# Altium schematic sheet Stuff.SchDoc
size A3
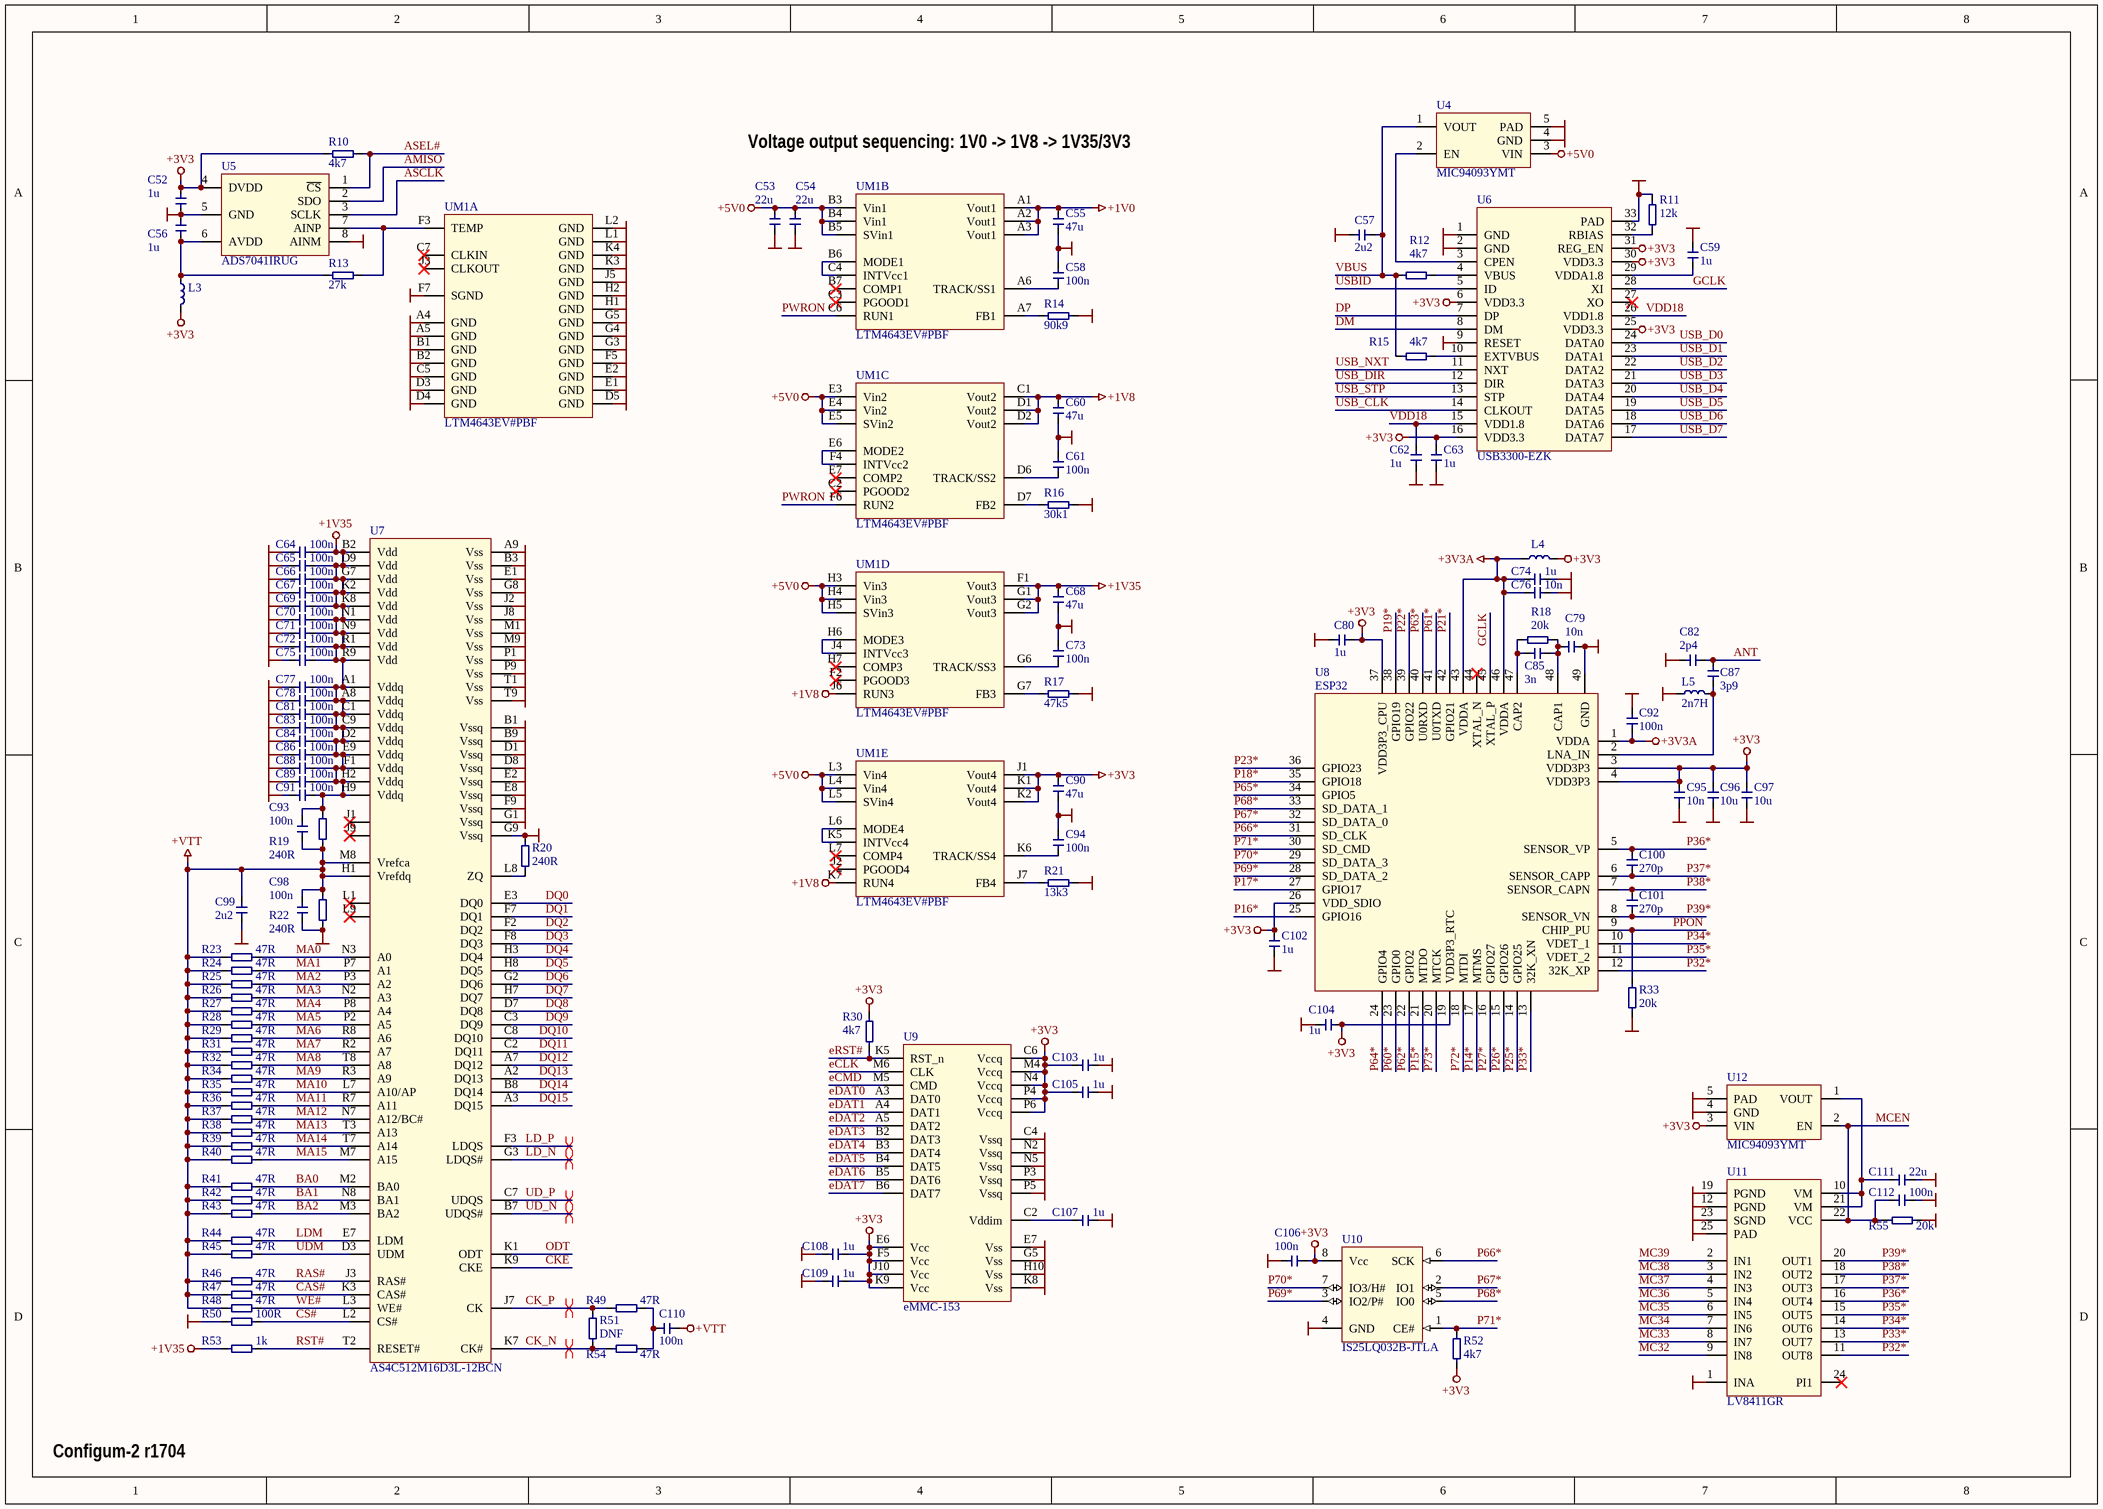
[diagram p0: Stuff.SchDoc]

## Parts
C52  1u  [_0201]
C53  22u  [_0805_CAP]
C54  22u  [_0805_CAP]
C55  47u  [_0805_CAP]
C56  1u  [_0201]
C57  2u2  [_0201]
C58  100n  [_0201]
C59  1u  [_0201]
C60  47u  [_0805_CAP]
C61  100n  [_0201]
C62  1u  [_0201]
C63  1u  [_0201]
C64  100n  [_0201]
C65  100n  [_0201]
C66  100n  [_0201]
C67  100n  [_0201]
C68  47u  [_0805_CAP]
C69  100n  [_0201]
C70  100n  [_0201]
C71  100n  [_0201]
C72  100n  [_0201]
C73  100n  [_0201]
C74  1u  [_0201]
C75  100n  [_0201]
C76  10n  [_0201]
C77  100n  [_0201]
C78  100n  [_0201]
C79  10n  [_0201]
C80  1u  [_0201]
C81  100n  [_0201]
C82  2p4  [_0201]
C83  100n  [_0201]
C84  100n  [_0201]
C85  3n  [_0201]
C86  100n  [_0201]
C87  3p9  [_0201]
C88  100n  [_0201]
C89  100n  [_0201]
C90  47u  [_0805_CAP]
C91  100n  [_0201]
C92  100n  [_0201]
C93  100n  [_0201]
C94  100n  [_0201]
C95  10n  [_0201]
C96  10u  [_0603]
C97  10u  [_0603]
C98  100n  [_0201]
C99  2u2  [_0201]
C100  270p  [_0201]
C101  270p  [_0201]
C102  1u  [_0201]
C103  1u  [_0201]
C104  1u  [_0201]
C105  1u  [_0201]
C106  100n  [_0201]
C107  1u  [_0201]
C108  1u  [_0201]
C109  1u  [_0201]
C110  100n  [_0201]
C111  22u  [_0805_CAP]
C112  100n  [_0201]
L3  60R/100MHz  [_0201]  (value not drawn)
L4  60R/100MHz  [_0201]  (value not drawn)
L5  2n7H  [_0201]
R10  4k7  [_0201]
R11  12k  [_0201]
R12  4k7  [_0201]
R13  27k  [_0201]
R14  90k9  [_0201]
R15  4k7  [_0201]
R16  30k1  [_0201]
R17  47k5  [_0201]
R18  20k  [_0201]
R19  240R  [_0201]
R20  240R  [_0201]
R21  13k3  [_0201]
R22  240R  [_0201]
R23  47R  [_0201]
R24  47R  [_0201]
R25  47R  [_0201]
R26  47R  [_0201]
R27  47R  [_0201]
R28  47R  [_0201]
R29  47R  [_0201]
R30  4k7  [_0201]
R31  47R  [_0201]
R32  47R  [_0201]
R33  20k  [_0201]
R34  47R  [_0201]
R35  47R  [_0201]
R36  47R  [_0201]
R37  47R  [_0201]
R38  47R  [_0201]
R39  47R  [_0201]
R40  47R  [_0201]
R41  47R  [_0201]
R42  47R  [_0201]
R43  47R  [_0201]
R44  47R  [_0201]
R45  47R  [_0201]
R46  47R  [_0201]
R47  47R  [_0201]
R48  47R  [_0201]
R49  47R  [_0201]
R50  100R  [_0201]
R51  DNF  [_0201]
R52  4k7  [_0201]
R53  1k  [_0201]
R54  47R  [_0201]
R55  20k  [_0201]
U4  MIC94093YMT  [DFN65P120x120-4]
U5  ADS7041IRUG  [X2QFN50P150X150-8]
U6  USB3300-EZK  [QFN50P500X500-32V5N]
U7  AS4C512M16D3L-12BCN  [BGA96C80P9X16_900X1400X120]
U8  ESP32  [QFN40P600X600X90-49N-S470]
U9  eMMC-153  [BGA153C50P14X14_1150X1300X90]
U10  IS25LQ032B-JTLA  [SON80P300X60_HS-9L]
U11  LV8411GR  [QFN40P300X300X80_HS-25L]
U12  MIC94093YMT  [DFN65P120x120-4]
UM1  LTM4643EV#PBF  [LGA77C127P7X11_900X1500X182]  (parts A,B,C,D,E of 5)

## Nets
+1V0: C55.1 UM1.A1(Vout1) UM1.A2(Vout1) UM1.A3(Vout1)
+1V8: C60.1 UM1.C1(Vout2) UM1.D1(Vout2) UM1.D2(Vout2) UM1.J6(RUN3) UM1.K7(RUN4)
+1V35: C64.1 C65.1 C66.1 C67.1 C68.1 C69.1 C70.1 C71.1 C72.1 C75.1 C77.1 C78.1 C81.1 C83.1 C84.1 C86.1 C88.1 C89.1 C91.1 C93.1 R19.2 R53.1 U7.A1(Vddq) U7.A8(Vddq) U7.B2(Vdd) U7.C1(Vddq) U7.C9(Vddq) U7.D2(Vddq) U7.D9(Vdd) U7.E9(Vddq) U7.F1(Vddq) U7.G7(Vdd) U7.H2(Vddq) U7.H9(Vddq) U7.K2(Vdd) U7.K8(Vdd) U7.N1(Vdd) U7.N9(Vdd) U7.R1(Vdd) U7.R9(Vdd) UM1.F1(Vout3) UM1.G1(Vout3) UM1.G2(Vout3)
+3V3: C52.2 C63.2 C80.2 C90.1 C95.2 C96.2 C97.2 C102.1 C103.2 C104.1 C105.2 C106.1 C108.1 C109.2 L3.1 L4.2 R10.2 R30.2 R52.1 U5.4(DVDD) U6.6(VDD3.3) U6.16(VDD3.3) U6.25(VDD3.3) U6.30(VDD3.3) U6.31(REG_EN) U8.3(VDD3P3) U8.4(VDD3P3) U8.19(VDD3P3_RTC) U8.26(VDD_SDIO) U8.37(VDD3P3_CPU) U9.C6(Vccq) U9.E6(Vcc) U9.F5(Vcc) U9.J10(Vcc) U9.K9(Vcc) U9.M4(Vccq) U9.N4(Vccq) U9.P4(Vccq) U9.P6(Vccq) U10.8(Vcc) U12.3(VIN) UM1.J1(Vout4) UM1.K1(Vout4) UM1.K2(Vout4)
+3V3A: C74.2 C76.2 C92.2 L4.1 U8.1(VDDA) U8.43(VDDA) U8.46(VDDA)
+5V0: C53.1 C54.1 U4.3(VIN) UM1.B3(Vin1) UM1.B4(Vin1) UM1.B5(SVin1) UM1.E3(Vin2) UM1.E4(Vin2) UM1.E5(SVin2) UM1.H3(Vin3) UM1.H4(Vin3) UM1.H5(SVin3) UM1.L3(Vin4) UM1.L4(Vin4) UM1.L5(SVin4)
+VTT: C93.2 C98.1 C99.1 C110.2 R19.1 R22.2 R23.1 R24.1 R25.1 R26.1 R27.1 R28.1 R29.1 R31.1 R32.1 R34.1 R35.1 R36.1 R37.1 R38.1 R39.1 R40.1 R41.1 R42.1 R43.1 R44.1 R45.1 R46.1 R47.1 R48.1 U7.H1(Vrefdq) U7.M8(Vrefca)
GND: C52.1 C53.2 C54.2 C55.2 C56.2 C57.1 C58.2 C59.1 C60.2 C61.2 C62.1 C63.1 C64.2 C65.2 C66.2 C67.2 C68.2 C69.2 C70.2 C71.2 C72.2 C73.2 C74.1 C75.2 C76.1 C77.2 C78.2 C79.1 C80.1 C81.2 C82.1 C83.2 C84.2 C86.2 C88.2 C89.2 C90.2 C91.2 C92.1 C94.2 C95.1 C96.1 C97.1 C98.2 C99.2 C102.2 C103.1 C104.2 C105.1 C106.2 C107.1 C108.2 C109.1 C111.2 C112.1 L5.1 R11.1 R14.2 R16.2 R17.2 R20.2 R21.2 R22.1 R33.1 R50.1 R55.1 U4.4(GND) U4.5(PAD) U5.5(GND) U5.8(AINM) U6.1(GND) U6.2(GND) U6.9(RESET) U6.33(PAD) U7.A9(Vss) U7.B1(Vssq) U7.B3(Vss) U7.B9(Vssq) U7.D1(Vssq) U7.D8(Vssq) U7.E1(Vss) U7.E2(Vssq) U7.E8(Vssq) U7.F9(Vssq) U7.G1(Vssq) U7.G8(Vss) U7.G9(Vssq) U7.J2(Vss) U7.J8(Vss) U7.M1(Vss) U7.M9(Vss) U7.P1(Vss) U7.P9(Vss) U7.T1(Vss) U7.T9(Vss) U8.49(GND) U9.C4(Vssq) U9.E7(Vss) U9.G5(Vss) U9.H10(Vss) U9.K8(Vss) U9.N2(Vssq) U9.N5(Vssq) U9.P3(Vssq) U9.P5(Vssq) U10.4(GND) U11.1(INA) U11.12(PGND) U11.19(PGND) U11.23(SGND) U11.25(PAD) U12.4(GND) U12.5(PAD) UM1.A4(GND) UM1.A5(GND) UM1.B1(GND) UM1.B2(GND) UM1.C5(GND) UM1.D3(GND) UM1.D4(GND) UM1.D5(GND) UM1.E1(GND) UM1.E2(GND) UM1.F5(GND) UM1.F7(SGND) UM1.G3(GND) UM1.G4(GND) UM1.G5(GND) UM1.H1(GND) UM1.H2(GND) UM1.J5(GND) UM1.K3(GND) UM1.K4(GND) UM1.L1(GND) UM1.L2(GND)
AMISO: U5.2(SDO)
ANT: C82.2 C87.1
ASCLK: U5.3(SCLK)
ASEL#: R10.1 U5.1(~{CS})
BA0: R41.2 U7.M2(BA0)
BA1: R42.2 U7.N8(BA1)
BA2: R43.2 U7.M3(BA2)
CAS#: R47.2 U7.K3(CAS#)
CK_N: R51.2 R54.2 U7.K7(CK#)
CK_P: R49.2 R51.1 U7.J7(CK)
CKE: U7.K9(CKE)
CS#: R50.2 U7.L2(CS#)
DM: U6.8(DM)
DP: U6.7(DP)
DQ0: U7.E3(DQ0)
DQ1: U7.F7(DQ1)
DQ2: U7.F2(DQ2)
DQ3: U7.F8(DQ3)
DQ4: U7.H3(DQ4)
DQ5: U7.H8(DQ5)
DQ6: U7.G2(DQ6)
DQ7: U7.H7(DQ7)
DQ8: U7.D7(DQ8)
DQ9: U7.C3(DQ9)
DQ10: U7.C8(DQ10)
DQ11: U7.C2(DQ11)
DQ12: U7.A7(DQ12)
DQ13: U7.A2(DQ13)
DQ14: U7.B8(DQ14)
DQ15: U7.A3(DQ15)
eCLK: U9.M6(CLK)
eCMD: U9.M5(CMD)
eDAT0: U9.A3(DAT0)
eDAT1: U9.A4(DAT1)
eDAT2: U9.A5(DAT2)
eDAT3: U9.B2(DAT3)
eDAT4: U9.B3(DAT4)
eDAT5: U9.B4(DAT5)
eDAT6: U9.B5(DAT6)
eDAT7: U9.B6(DAT7)
eRST#: R30.1 U9.K5(RST_n)
GCLK: U6.28(XI) U8.45(XTAL_P)
LD_N: U7.G3(LDQS#)
LD_P: U7.F3(LDQS)
LDM: R44.2 U7.E7(LDM)
MA0: R23.2 U7.N3(A0)
MA1: R24.2 U7.P7(A1)
MA2: R25.2 U7.P3(A2)
MA3: R26.2 U7.N2(A3)
MA4: R27.2 U7.P8(A4)
MA5: R28.2 U7.P2(A5)
MA6: R29.2 U7.R8(A6)
MA7: R31.2 U7.R2(A7)
MA8: R32.2 U7.T8(A8)
MA9: R34.2 U7.R3(A9)
MA10: R35.2 U7.L7(A10/AP)
MA11: R36.2 U7.R7(A11)
MA12: R37.2 U7.N7(A12/BC#)
MA13: R38.2 U7.T3(A13)
MA14: R39.2 U7.T7(A14)
MA15: R40.2 U7.M7(A15)
MC32: U11.9(IN8)
MC33: U11.8(IN7)
MC34: U11.7(IN6)
MC35: U11.6(IN5)
MC36: U11.5(IN4)
MC37: U11.4(IN3)
MC38: U11.3(IN2)
MC39: U11.2(IN1)
MCEN: C112.2 R55.2 U11.22(VCC) U12.2(EN)
ODT: U7.K1(ODT)
P14*: U8.17(MTMS)
P15*: U8.21(MTDO)
P16*: U8.25(GPIO16)
P17*: U8.27(GPIO17)
P18*: U8.35(GPIO18)
P19*: U8.38(GPIO19)
P21*: U8.42(GPIO21)
P22*: U8.39(GPIO22)
P23*: U8.36(GPIO23)
P25*: U8.14(GPIO25)
P26*: U8.15(GPIO26)
P27*: U8.16(GPIO27)
P32*: U8.12(32K_XP) U11.11(OUT8)
P33*: U8.13(32K_XN) U11.13(OUT7)
P34*: U8.10(VDET_1) U11.14(OUT6)
P35*: U8.11(VDET_2) U11.15(OUT5)
P36*: C100.2 U8.5(SENSOR_VP) U11.16(OUT4)
P37*: C100.1 U8.6(SENSOR_CAPP) U11.17(OUT3)
P38*: C101.2 U8.7(SENSOR_CAPN) U11.18(OUT2)
P39*: C101.1 U8.8(SENSOR_VN) U11.20(OUT1)
P60*: U8.23(GPIO0)
P61*: U8.41(U0TXD)
P62*: U8.22(GPIO2)
P63*: U8.40(U0RXD)
P64*: U8.24(GPIO4)
P65*: U8.34(GPIO5)
P66*: U8.31(SD_CLK) U10.6(SCK)
P67*: U8.32(SD_DATA_0) U10.2(IO1)
P68*: U8.33(SD_DATA_1) U10.5(IO0)
P69*: U8.28(SD_DATA_2) U10.3(IO2/P#)
P70*: U8.29(SD_DATA_3) U10.7(IO3/H#)
P71*: R52.2 U8.30(SD_CMD) U10.1(CE#)
P72*: U8.18(MTDI)
P73*: U8.20(MTCK)
PPON: R33.2 U8.9(CHIP_PU)
PWRON: UM1.C6(RUN1) UM1.F6(RUN2)
RAS#: R46.2 U7.J3(RAS#)
RST#: R53.2 U7.T2(RESET#)
UD_N: U7.B7(UDQS#)
UD_P: U7.C7(UDQS)
UDM: R45.2 U7.D3(UDM)
USB_CLK: U6.14(CLKOUT)
USB_D0: U6.24(DATA0)
USB_D1: U6.23(DATA1)
USB_D2: U6.22(DATA2)
USB_D3: U6.21(DATA3)
USB_D4: U6.20(DATA4)
USB_D5: U6.19(DATA5)
USB_D6: U6.18(DATA6)
USB_D7: U6.17(DATA7)
USB_DIR: U6.12(DIR)
USB_NXT: U6.11(NXT)
USB_STP: U6.13(STP)
USBID: U6.5(ID)
VBUS: C57.2 R12.1 R15.1 U4.1(VOUT)
VDD18: C62.2 U6.15(VDD1.8) U6.26(VDD1.8)
WE#: R48.2 U7.L3(WE#)
NetC56_1: C56.1 L3.2 R13.2 U5.6(AVDD)
NetC58_1: C58.1 UM1.A6(TRACK/SS1)
NetC59_2: C59.2 U6.29(VDDA1.8)
NetC61_1: C61.1 UM1.D6(TRACK/SS2)
NetC73_1: C73.1 UM1.G6(TRACK/SS3)
NetC79_2: C79.2 C85.1 R18.2 U8.48(CAP1)
NetC85_2: C85.2 R18.1 U8.47(CAP2)
NetC87_2: C87.2 L5.2 U8.2(LNA_IN)
NetC94_1: C94.1 UM1.K6(TRACK/SS4)
NetC107_2: C107.2 U9.C2(Vddim)
NetC110_1: C110.1 R49.1 R54.1
NetC111_1: C111.1 U11.10(VM) U11.21(VM) U12.1(VOUT)
NetR11_2: R11.2 U6.32(RBIAS)
NetR12_2: R12.2 U6.4(VBUS)
NetR13_1: R13.1 U5.7(AINP) UM1.F3(TEMP)
NetR14_1: R14.1 UM1.A7(FB1)
NetR15_2: R15.2 U6.10(EXTVBUS)
NetR16_1: R16.1 UM1.D7(FB2)
NetR17_1: R17.1 UM1.G7(FB3)
NetR20_1: R20.1 U7.L8(ZQ)
NetR21_1: R21.1 UM1.J7(FB4)
NetU4_2: U4.2(EN) U6.3(CPEN)
NetUM1_B6: UM1.B6(MODE1) UM1.C4(INTVcc1)
NetUM1_E6: UM1.E6(MODE2) UM1.F4(INTVcc2)
NetUM1_H6: UM1.H6(MODE3) UM1.J4(INTVcc3)
NetUM1_K5: UM1.K5(INTVcc4) UM1.L6(MODE4)

Not connected (* = marked no-connect by the designer): U6 27(XO)*; U7 J1* J9* L1* L9*; U8 44(XTAL_N)*; U11 24(PI1)*; UM1 B7(COMP1)* C2(PGOOD2)* C3(PGOOD1)* C7(CLKIN)* E7(COMP2)* F2(PGOOD3)* H7(COMP3)* J2(PGOOD4)* J3(CLKOUT)* L7(COMP4)*

## Layout directives
differential pair: CK_N, CK_P, LD_N, LD_P, UD_N, UD_P

## Notes on the sheet
- Voltage output sequencing: 1V0 -> 1V8 -> 1V35/3V3
- Configum-2 r1704

## Library data of the parts
C52-C112 = Capacitor
L3-L5 = Inductor
R10-R55 = Resistor
  R10-R51 R53-R55: Digikey: RMCF0402FT3K30CT-ND
U4 U12 = MIC9409x (1.2x1.2 Thin MLF): High-side load switch for consumer applications; Manufacturer: Microchip
U5 = ADS7041 (Q2QFN 1.5x1.5): Ultra-Low Power, Ultra-Small Size, 10-Bit, 1-MSPS, SAR ADC; Manufacturer: Texas Instruments
U6 = USB3300: Hi-Speed USB Host, Device or OTG PHY with  ULPI Low Pin Interface; Manufacturer: Microchip
U7 = AS4C512M16D3L: DDR3L RAM 8Gb (512Mx16); Manufacturer: Alliance Semiconductor; Organisation: DDR3L (1.35V) 8x64Mx16
U8 = ESP32: WiFi, BT4.2, 2xCPU integrated solution; Manufacturer: Espressif
U9 = eMMC: eMMC memory; Manufacturer: Micron
U10 = SPI Flash 8pin: Standard 8-pin SPI flash memory
U11 = LV8411GR: 4-channel single chip motor driver IC; Manufacturer: On Semiconductor
UM1 = LTM4643: Ultrathin Quad Module Regulator with Configurable 3A Output Array; Manufacturer: Linear